# Altium schematic sheet AFBR-TX-fiber_optic_transmiter.SchDoc
size A4; SheetNumber: 3; SheetTotal: 3
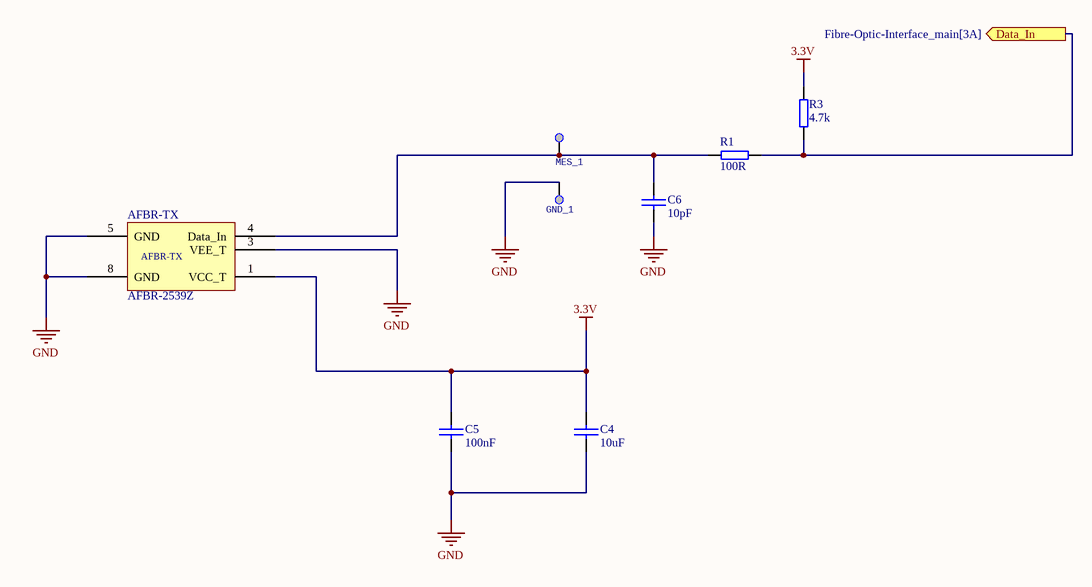
[diagram p0: AFBR-TX-fiber_optic_transmiter.SchDoc]

## Parts
AFBR-TX  AFBR-2539Z  [AFBR-TX/RX-HORIZONTAL]
C4  10uF  [1206]
C5  100nF  [0603C]
C6  10pF  [0603C]
GND_1  PK_1  [PK]  (value not drawn)  (no BOM)
MES_1  PK_1  [PK]  (value not drawn)  (no BOM)
R1  100R  [0603R]
R3  4.7k  [0603R]

## Ports
Data_In (out, see Fibre-Optic-Interface_main[3A])

## Nets
3.3V: AFBR-TX.1(VCC_T) C4.1 C5.1 R3.2
GND: AFBR-TX.3(VEE_T) AFBR-TX.5(GND) AFBR-TX.8(GND) C4.2 C5.2 C6.2 GND_1.1
Data_In: R1.2 R3.1 ; port Data_In
NetAFBR-TX_4: AFBR-TX.4(Data_In) C6.1 MES_1.1 R1.1

## Library data of the parts
AFBR-TX = AFBR-TX: Fiber Optic Transmitters, Receivers, Transceivers VL V 50MBd RX inv
C4 = C_1: Capacitor
C5 = C: Capacitor
C6 = C_3: Capacitor
GND_1 MES_1 = PK_1: Punkt; ClassName: Mechanical
R1 = R_1
R3 = R